# Altium schematic sheet RS232 Comms.SchDoc: Ravage - RS232 Comms
size A4; Address1: Drawn By:; Address2: Dan Visser; DocumentNumber: A; Revision: 0.1-alpha; SheetNumber: 4; SheetTotal: 16
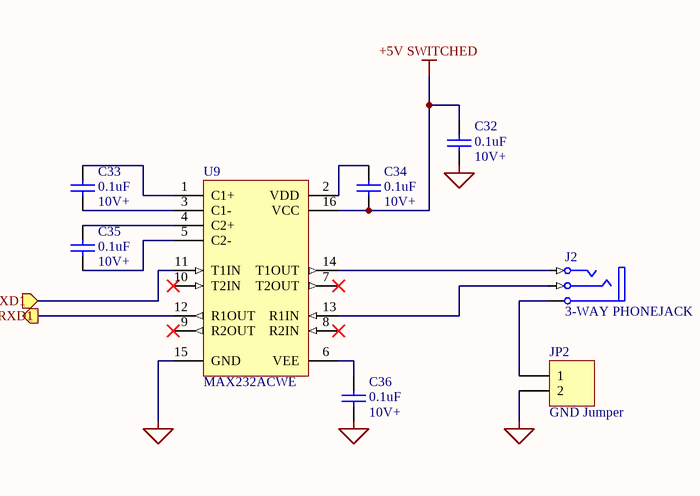
[diagram p0: RS232 Comms.SchDoc]

## Parts
C32  value 0.1uF  [RAD-0.3]
C33  value 0.1uF  [RAD-0.3]
C34  value 0.1uF  [RAD-0.3]
C35  value 0.1uF  [RAD-0.3]
C36  value 0.1uF  [RAD-0.3]
J2  3-WAY PHONEJACK  [JACK/6-V3]
JP2  GND Jumper  [HDR1X2]
U9  MAX232ACWE  [WSO16_N]

## Ports
CPU RXD1 (out), CPU TXD1 (in)

## Nets
+5V SWITCHED: C32.2 C34.1 U9.16(VCC)
NetC32_1: C32.1 C36.1 JP2.2 U9.15(GND)
CPU RXD1: U9.12(R1OUT) ; port CPU RXD1
CPU TXD1: U9.11(T1IN) ; port CPU TXD1
NetC33_1: C33.1 U9.3(C1-)
NetC33_2: C33.2 U9.1(C1+)
NetC34_2: C34.2 U9.2(VDD)
NetC35_1: C35.1 U9.5(C2-)
NetC35_2: C35.2 U9.4(C2+)
NetC36_2: C36.2 U9.6(VEE)
NetJ2_1: J2.1(T) U9.14(T1OUT)
NetJ2_3: J2.3(R) U9.13(R1IN)
NetJ2_5: J2.5(S) JP2.1

Not connected (* = marked no-connect by the designer): U9 7(T2OUT)* 8(R2IN)* 9(R2OUT)* 10(T2IN)*

## Notes on the sheet
- (near C32) 10V+
- (near C33) 10V+
- (near C34) 10V+
- (near C35) 10V+
- (near C36) 10V+
- Title
- Size:
- Date:
- A4
- Number:
- Time:
- Revision:
- Sheet
- of

## Library data of the parts
C32-C36 = Cap: Capacitor; Published: 8-Jun-2000; LatestRevisionDate: 17-Jul-2002; LatestRevisionNote: Re-released for DXP Platform.; PackageReference: RAD-0.3; Publisher: Altium Limited; PackageDescription: Radial Cap, Thru-Hole; 2 Leads; 0.3 in Pin Spacing
J2 = Phonejack3: Jack Socket, 1/4" [6.5mm], Thru-Hole, Vertical, 3-Conductor Open Circuit (Non-Normalling); PackageDocument: 2003; PCB_Layout: Complies with manufacturer's recommendation.; DrillAndSlotSize: Corresponds to nominal value.; Published: 15-Jul-2004; LatestRevisionDate: 15-Jul-2004; LatestRevisionNote: Component Replaced.; DatasheetDocument: 2003; PackageReference: S1VS_SSS; Publisher: Altium Limited; ComponentLink1Description: Manufacturer Link; ComponentLink1URL: http://www.cliffuk.co.uk/
JP2 = Header 2: Header, 2-Pin; LatestRevisionDate: 17-Jul-2002; LatestRevisionNote: Re-released for DXP Platform.; Publisher: Altium Limited
U9 = MAX232ACWE: +5V Powered, Multi-Channel RS-232 Driver/Receiver; Published: 16-Jan-2001; LatestRevisionDate: 13-Apr-2006; LatestRevisionNote: IPC-7351 Footprint Added.; PackageReference: WSO16; Publisher: Altium Limited; PackageDescription: 16-Pin Small Outline Integrated Circuit 1.27 mm Pitch; Code_JEDEC: MS-013-AA; Code_IPC: SOIC127P1030-16; ComponentLink1Description: Manufacturer Link; ComponentLink1URL: http://www.maxim-ic.com/; ComponentLink2Description: Datasheet; ComponentLink2URL: http://pdfserv.maxim-ic.com/en/ds/MAX220-MAX249.pdf